# Altium schematic sheet Convertidor.SchDoc
size A4; SheetNumber: 2; SheetTotal: 3
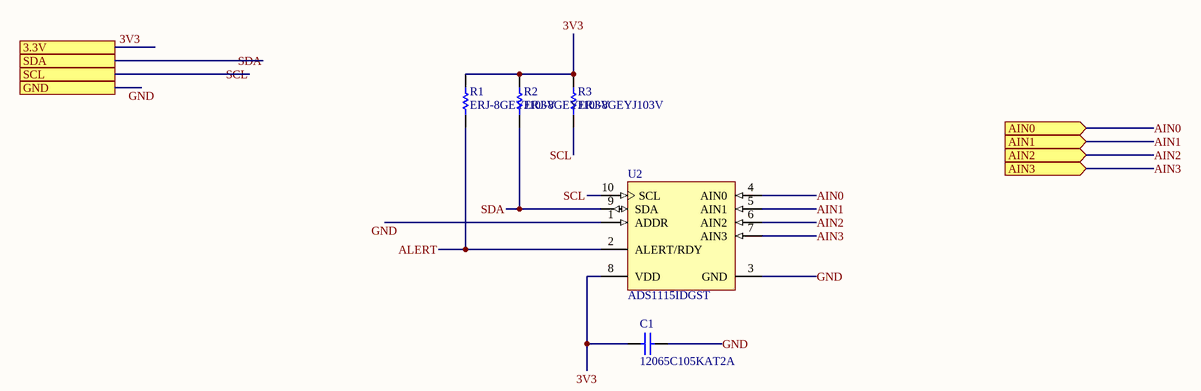
[diagram p0: Convertidor.SchDoc]

## Parts
C1  12065C105KAT2A  [CAPC3216X180X50LL20T25]
R1  ERJ-8GEYJ103V  [RESC3216X70X50NL05T20]
R2  ERJ-8GEYJ103V  [RESC3216X70X50NL05T20]
R3  ERJ-8GEYJ103V  [RESC3216X70X50NL05T20]
U2  ADS1115IDGST  [TI-DGS10_M]

## Ports
3.3V, AIN0 (in), AIN1 (in), AIN2 (in), AIN3 (in), GND, SCL, SDA

## Nets
3V3: C1.2 R1.2 R2.2 R3.2 U2.8(VDD) ; port 3.3V
AIN0: U2.4(AIN0) ; port AIN0
AIN1: U2.5(AIN1) ; port AIN1
AIN2: U2.6(AIN2) ; port AIN2
AIN3: U2.7(AIN3) ; port AIN3
ALERT: R1.1 U2.2(ALERT/RDY)
GND: C1.1 U2.1(ADDR) U2.3(GND) ; port GND
SCL: R3.1 U2.10(SCL) ; port SCL
SDA: R2.1 U2.9(SDA) ; port SDA

## Library data of the parts
C1 = CMP-2000-05866-1: Chip Capacitor, 1 uF, +/- 10%, 50 V, -55 to 125 degC, 1206 (3216 Metric), RoHS, Tape and Reel; Manufacturer: AVX; Capacitance: 1µF; Dielectric: X7R; Rated Voltage: 50V; Datasheet URL: http://datasheets.avx.com/X7RDielectric.pdf; Package Reference: 1206; Tolerance (%): ±10%; Mounting Technology: SurfaceMount; Case Size/Dimension: 1206; Package Description: 2-Pin Surface Mount Device, Body 3.2 x 1.6 mm; Datasheet Version: 07/2016; Manufacturer URL: http://www.avx.com/
R1-R3 = CMP-2003-00545-1: Manufacturer: Panasonic; Part Number: ERJ-8GEYJ103V
U2 = CMP-0003-00378-2: 16-Bit ADC with Integrated Multiplexer, PGA, Comparator, Oscillator, and Reference, -40 to 125 degC, 10-pin SOP (DGS10), Green (RoHS & no Sb/Br); Manufacturer: Texas Instruments; Sample Rate (max)(SPS): 860; SubFamily: Precision ADC (<=10MSPS); Architecture: Delta-Sigma; Digital Supply(Min)(V): 2; Resolution(Bits): 16; Digital Supply(Max)(V): 5.5; INL(Max)(+/-LSB): 1; Interface: Serial I2C; # Input Channels: 4; Eco-Plan: Green (RoHS & no Sb/Br); PackageDescription: 10-Pin Plastic Small Outline, Body 3 x 3 mm, Pitch 0.5 mm; Mounting Technology: Surface Mount; PackageReference: DGS10; DatasheetVersion: SBAS444B; ComponentLink3Description: Package Specification; ComponentLink1Description: Manufacturer URL; PartNumber: ADS1115IDGST; ComponentLink3URL: http://www.ti.com/lit/ml/mpds035b/mpds035b.pdf; ComponentLink2URL: http://www.ti.com/general/docs/lit/getliterature.tsp?genericPartNumber=ADS1115&fileType=pdf; Analog Voltage AV/DD(Min)(V): 2; ComponentLink2Description: Datasheet; PackageVersion: 4073272/C, 02/2004; Analog Voltage AV/DD(Max)(V): 5.5; Code_JEDEC: MO-153; ComponentLink1URL: http://www.ti.com/